# EAGLE design schematic (EAGLE 7.2.0)
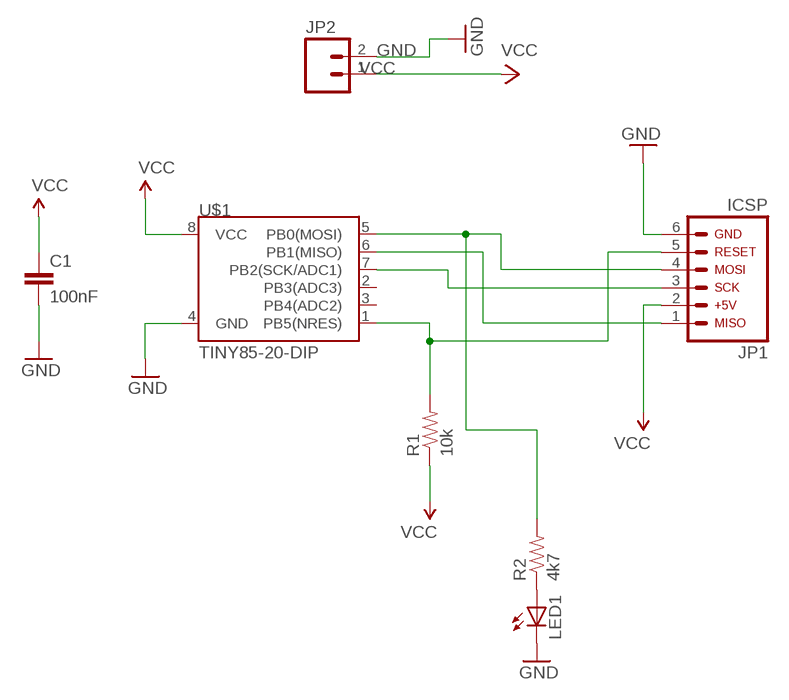
[diagram p0: schematic, sheet 1]

## Parts
C1  100nF  0.1UF-50V-20%(PTH)KIT-EZ  [CAP-PTH-SMALL-KIT]
JP1  ARDUINO_CONN-ICSP  [CONN-2X03]
JP2  M02LOCK  [1X02_LOCK]
LED1  LED5MM  [LED5MM]
R1  10k  RESISTORPTH-1/6W  [1/6W-RES]
R2  4k7  RESISTORPTH-1/6W  [1/6W-RES]
U$1  TINY85-20-DIP  ATTINY45TINY85-20-DIP  [DIP08]

## Nets
GND: C1.2 JP1.6 JP2.2 LED1.K(C) U$1.4(GND)
N$1: JP1.1 U$1.6(PB1(MISO))
N$2: JP1.4 R2.2 U$1.5(PB0(MOSI))
N$4: JP1.3 U$1.7(PB2(SCK/ADC1))
N$5: JP1.5 R1.2 U$1.1(PB5(NRES))
N$6: LED1.A R2.1
VCC: C1.1 JP1.2 JP2.1 R1.1 U$1.8(VCC)
Unconnected: U$1.2(PB3(ADC3)) U$1.3(PB4(ADC2))

## Library data of the parts
C1 = SparkFun-Capacitors:0.1UF-50V-20%(PTH): CAP-08370; PROD_ID: CAP-08370
JP1 = arduino_jw:ARDUINO_CONN-ICSP: Arduino ICSP I/O Header This is the ICSP I/O header on the Arduino Uno R3. This connector is labeled with the following pin assignments: MISO +5V SCK MOSI RESET GND NOTE: Be sure you install this connector with the correct orientation on your PCB layout. Pin 1 has a square pad to assist with orientation.
JP2 = SparkFun-Connectors:M02: Standard 2-pin 0.1" header. Use with - straight break away headers ( PRT-00116) - right angle break away headers (PRT-00553) - swiss pins (PRT-00743) - machine pins (PRT-00117) - female headers (PRT-00115) Molex polarized connector foot print use with: PRT-08233 with associated crimp pins and housings. 2.54_SCREWTERM for use with PRT-10571. 3.5mm Screw Terminal footprints for PRT-08084 5mm Screw Terminal footprints for use with PRT-08432
LED1 = adafruit:LED: LED OSRAM: - CHIPLED LG R971, LG N971, LY N971, LG Q971, LY Q971, LO R971, LY R971 LH N974, LH R974 LS Q976, LO Q976, LY Q976 LO Q996 - Hyper CHIPLED LW Q18S LB Q993, LB Q99A, LB R99A - SideLED LS A670, LO A670, LY A670, LG A670, LP A670 LB A673, LV A673, LT A673, LW A673 LH A674 LY A675 LS A676, LA A676, LO A676, LY A676, LW A676 LS A679, LY A679, LG A679 - Hyper Micro SIDELED® LS Y876, LA Y876, LO Y876, LY Y876 LT Y87S - SmartLED LW L88C, LW L88S LB L89C, LB L89S, LG L890 LS L89K, LO L89K, LY L89K LS L896, LA L896, LO L896, LY L896 - TOPLED LS T670, LO T670, LY T670, LG T670, LP T670 LSG T670, LSP T670, LSY T670, LOP T670, LYG T670 LG T671, LOG T671, LSG T671 LB T673, LV T673, LT T673, LW T673 LH T674 LS T676, LA T676, LO T676, LY T676, LB T676, LH T676, LSB T676, LW T676 LB T67C, LV T67C, LT T67C, LS T67K, LO T67K, LY T67K, LW E67C LS E67B, LA E67B, LO E67B, LY E67B, LB E67C, LV E67C, LT E67C LW T67C LS T679, LY T679, LG T679 LS T770, LO T770, LY T770, LG T770, LP T770 LB T773, LV T773, LT T773, LW T773 LH T774 LS E675, LA E675, LY E675, LS T675 LS T776, LA T776, LO T776, LY T776, LB T776 LHGB T686 LT T68C, LB T68C - Hyper Mini TOPLED® LB M676 - Mini TOPLED Santana® LG M470 LS M47K, LO M47K, LY M47K Source: http://www.osram.convergy.de/
R1 R2 = SparkFun-Resistors:RESISTOR: Resistor Basic schematic elements and footprints for 0603, 1206, and PTH resistors.
U$1 = SparkFun-DigitalIC:ATTINY45: Atmel 8-pin 2/4/8kB flash uC; PROD_ID: IC-09445

## Board
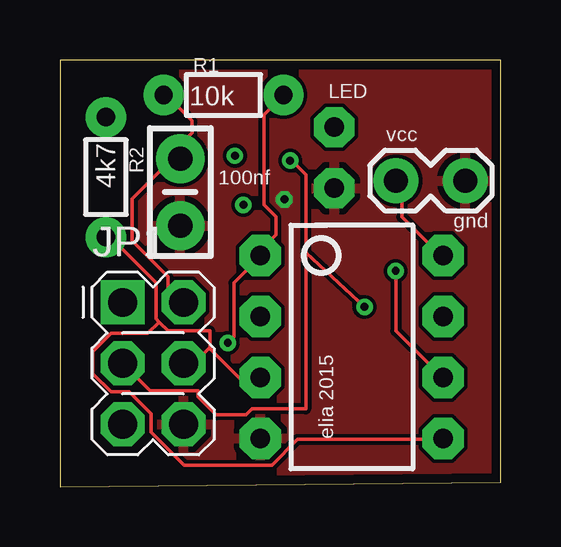
[diagram p1: board, top side]
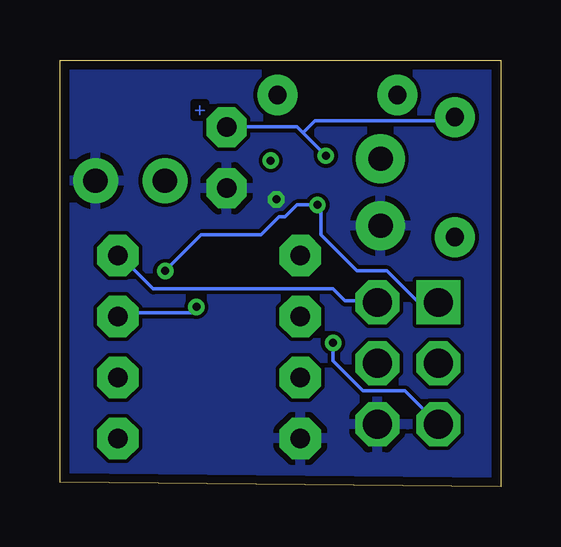
[diagram p2: board, bottom side, seen from below]

Size 18.39 x 17.79 mm. Coordinates in mm from the lower left corner, seen from the top.
Outline: 0,0 18.39,0.2 18.39,17.79 0,17.79 0,0
Copper layers (1*16): Top 0.0356mm / dielectric 1.5011mm / Bottom 0.0356mm
Design rules "LaenPCBOrder": minimum track width 6mil, minimum drill 13mil, track to track 6mil, track to pad 6mil, pad to pad 6mil, via to via 6mil, smd to smd 6mil, copper to edge 15mil, drill to drill 6mil, minimum pad ring 7mil, minimum via ring 7mil, stop-mask expansion 3mil, vias tented up to drill 0mil, thermal gap 10mil

### Footprints (pad centres in the part's own frame; a part is rotated, then mirrored left to right if it is on the bottom)
CAP-PTH-SMALL-KIT = drill 1.016 pad 2.032: 1 -1.397,0; 2 1.397,0
CONN-2X03 = drill 1.2 pad 1.829 square: 1 0,0 | drill 1.2 pad 1.829 octagon: 2 2.54,0; 3 0,-2.54; 4 2.54,-2.54; 5 0,-5.08; 6 2.54,-5.08
1X02_LOCK = drill 1.016 pad 1.88: 1 -0.178,0; 2 2.718,0
LED5MM = drill 0.813 pad 1.676 octagon: A -1.27,0; K 1.27,0
1/6W-RES = drill 0.762 pad 1.676: 1 -2.5,0; 2 2.5,0
DIP08 = drill 0.813 pad 1.727 octagon: 1 -3.81,-3.81; 2 -1.27,-3.81; 3 1.27,-3.81; 4 3.81,-3.81; 5 3.81,3.81; 6 1.27,3.81; 7 -1.27,3.81; 8 -3.81,3.81

### Placement (x,y rotation side)
C1  5.02,12.28 270 top
JP1  2.61,7.69 0 top
JP2  14.19,12.76 0 top
LED1  11.44,13.72 270 top
R1  6.82,16.33 0 top
R2  1.92,12.91 270 top
U$1  12.17,5.83 270 top

### Tracks (layer width: path | path; a pad name or v marks a point on that pad's centre or on a via)
GND  (via drill 0.33)
  other vias: 9.36,11.98
  pour Bottom: 0,-0.2 23,0 22.8,24.6 -0.2,24.6
  pour Top: 0,0 21.8,0 23,0 23,24.6 0,24.6
N$1  (via drill 0.33)
  Top 0.152: v14,9 14,6.5 15.75,4.75 U$1.6
  Bottom 0.152: JP1.1 2.75,7.75 3.5,7.75 4.75,9 6,9 7.5,10.5 7.5,11.75 v7.65,11.75 8.5,11.75 9,11.25 9.25,11.25 10,10.5 12.5,10.5 v14,9
N$2
  Top 0.152: 4.13,6.87 4.5,6.5 6.25,6.5 6.25,5.75 | 4.13,6.87 4,7 4,8.5 2.5,10 2.5,10.25 2,10.25 R2.2 | 6.25,5.75 7.5,4.5 8.25,4.5 | 4.13,6.87 3.66,6.4 2.13,6.4 1.37,5.64 1.37,4.72 2.13,3.96 2.9,3.96 3.81,3.05 3.81,2.29 5.18,0.91 8.84,0.91 9.91,1.98 15.85,1.98 U$1.5 | JP1.4 5.18,5.18 5.64,5.18 6.25,5.79 6.25,5.75
N$4  (via drill 0.33)
  Top 0.152: 10.25,9.75 10.25,13 9.75,13.5 v9.6,13.6 | v12.7,7.5 10.25,9.75 | 10.25,9.75 10.25,3.25 8,3.25 7.75,3 6.5,3 5.75,3.75 5.75,4 3.75,4 2.75,5 JP1.3
  Bottom 0.152: v12.7,7.5 12.75,7.25 15.75,7.25 U$1.7
N$5  (via drill 0.33)
  Top 0.152: R1.2 9.25,16.25 8.5,15.5 8.5,11.75 9,11.25 9,10.5 8.5,10 8.5,9.75 U$1.1 8.25,9.5 7.25,8.5 7.25,6.25 v7,6
  Bottom 0.152: JP1.5 4,4 5.75,4 7,5.25 v7,6
N$6  (via drill 0.33)
  Bottom 0.152: 8.25,14.75 8.5,15 11.25,15 LED1.A | 8.25,14.75 v7.3,13.8 | 8.25,14.75 7.75,15.25 2,15.25 R2.1
VCC
  Top 0.152: U$1.8 15.75,9.75 14.25,11.25 14.25,12.75 JP2.1 | 5.25,14.25 5.25,13.75 C1.1 5.25,14.25 | 5.25,14.25 5.25,14.5 5.5,14.75 5.5,15.25 4.5,16.25 R1.1 | 5.25,14.25 3,12 3,10.25 4.5,8.75 4.5,8.25 5,7.75 JP1.2
  Bottom 0.152: U$1.8 15.75,9.5 14.5,8.25 7,8.25 6.5,7.75 5.25,7.75 JP1.2

### Text on the board
Bottom: +
tPlace: LED | vcc | 100nf | gnd | elia 2015